# Altium schematic sheet SCH_04_MCU.SchDoc
size A4; DrawnBy: Phung Nhat Minh; SheetNumber: 4; SheetTotal: 7
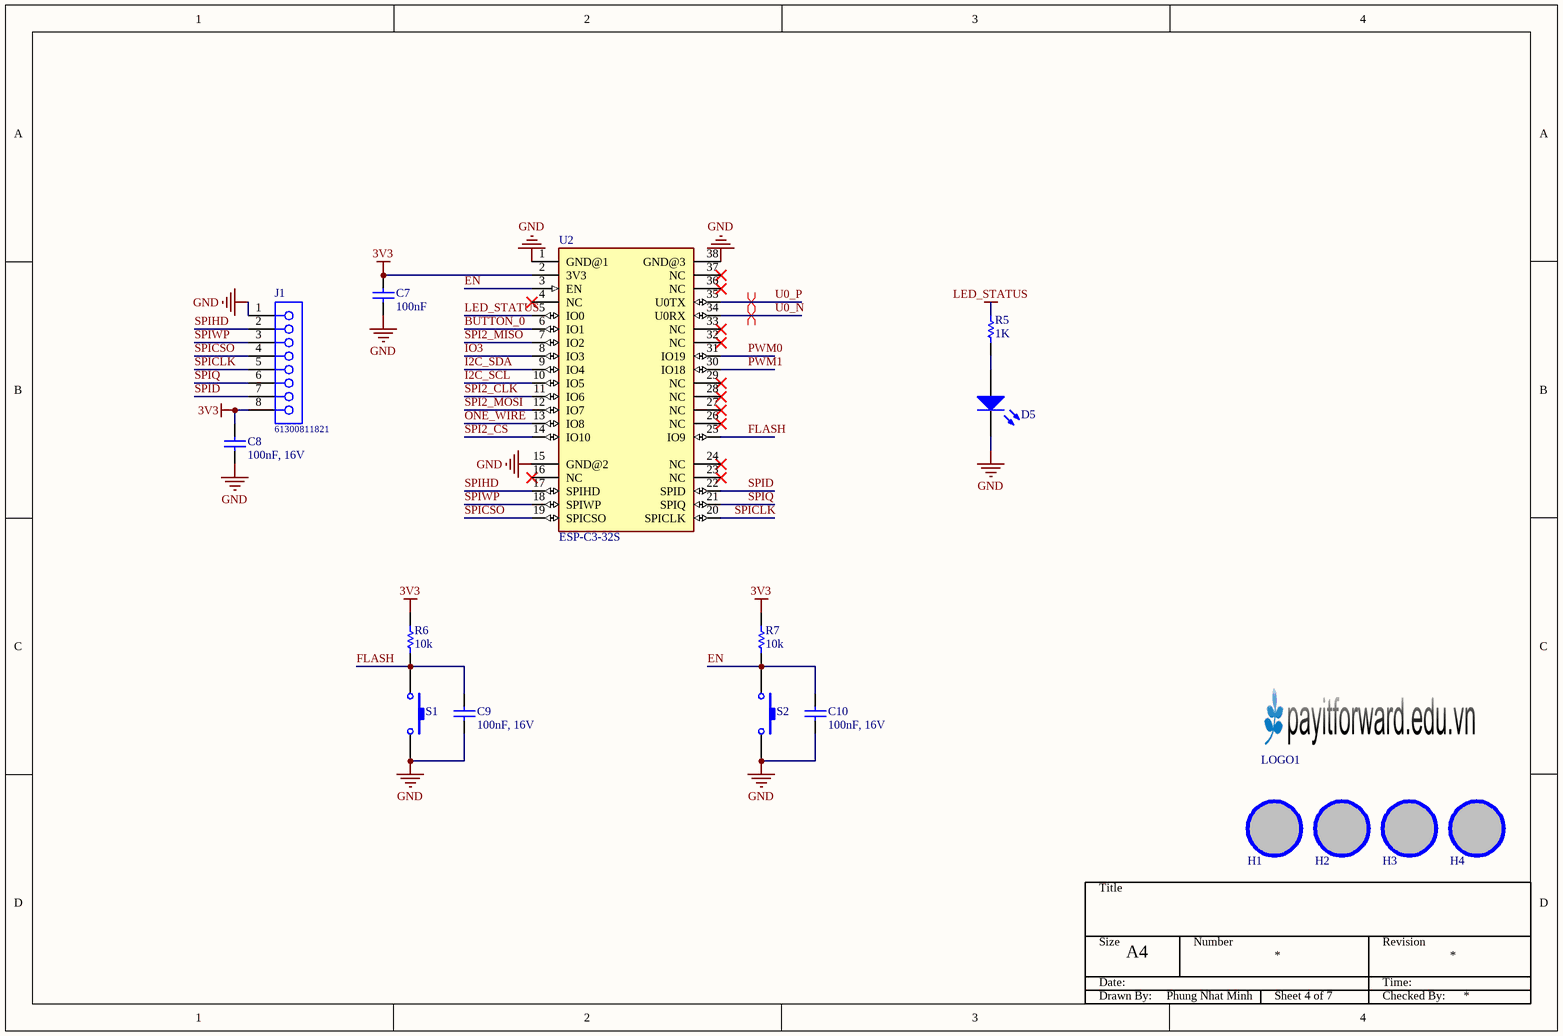
[diagram p0: SCH_04_MCU.SchDoc]

## Parts
C7  100nF  [WCAP-CSGP_0603_H=0.8mm_Reflow]
C8  100nF, 16V  [WCAP-CSGP_0603_H=0.8mm_Reflow]
C9  100nF, 16V  [WCAP-CSGP_0603_H=0.8mm_Reflow]
C10  100nF, 16V  [WCAP-CSGP_0603_H=0.8mm_Reflow]
D5  LED SMD  [LED_0805_Blue]  (value not drawn)
H1  Hole  [LO KHOAN 3MM]  (value not drawn)
H2  Hole  [LO KHOAN 3MM]  (value not drawn)
H3  Hole  [LO KHOAN 3MM]  (value not drawn)
H4  Hole  [LO KHOAN 3MM]  (value not drawn)
J1  61300811821  [61300811821]
LOGO1  LOGO PIF  [PIF LOGO BIG SSTOP]  (value not drawn)
R5  value 1K  [RES-SM-0603]  (hidden comment: RESISTOR SMD)
R6  value 10k  [RES-SM-0603]  (hidden comment: RESISTOR SMD)
R7  value 10k  [RES-SM-0603]  (hidden comment: RESISTOR SMD)
S1  Tact SW - 2Pin  [SW-SMD]  (value not drawn)
S2  Tact SW - 2Pin  [SW-SMD]  (value not drawn)
U2  ESP-C3-32S  [ESP-32S]

## Nets
3V3: C7.2 C8.2 J1.8 R6.1 R7.1 U2.2(3V3)
GND: C7.1 C8.1 C9.1 C10.1 D5.2(K) J1.1 S1.2 S2.2 U2.1(GND@1) U2.15(GND@2) U2.38(GND@3)
LED_STATUS: R5.2 U2.5(IO0)
BUTTON_0: U2.6(IO1)
EN: C10.2 R7.2 S2.1 U2.3(EN)
FLASH: C9.2 R6.2 S1.1 U2.25(IO9)
I2C_SCL: U2.10(IO5)
I2C_SDA: U2.9(IO4)
IO3: U2.8(IO3)
ONE_WIRE: U2.13(IO8)
PWM0: U2.31(IO19)
PWM1: U2.30(IO18)
SPI2_CLK: U2.11(IO6)
SPI2_CS: U2.14(IO10)
SPI2_MISO: U2.7(IO2)
SPI2_MOSI: U2.12(IO7)
SPICLK: J1.5 U2.20(SPICLK)
SPICSO: J1.4 U2.19(SPICSO)
SPID: J1.7 U2.22(SPID)
SPIHD: J1.2 U2.17(SPIHD)
SPIQ: J1.6 U2.21(SPIQ)
SPIWP: J1.3 U2.18(SPIWP)
U0_N: U2.34(U0RX)
U0_P: U2.35(U0TX)
NetD5_1: D5.1(A) R5.1

Not connected (* = marked no-connect by the designer): H1 1; H2 1; H3 1; H4 1; U2 4(NC)* 16(NC)* 23(NC)* 24(NC)* 26(NC)* 27(NC)* 28(NC)* 29(NC)* 32(NC)* 33(NC)* 36(NC)* 37(NC)*

## Layout directives
differential pair: U0_N, U0_P

## Notes on the sheet
- Title
- Size
- Date:
- A4
- Number
- Revision
- Time:
- Drawn By:
- Checked By:

## Library data of the parts
C7-C10 = 885012206046: WCAP-CSGP Multilayer Ceramic Chip Capacitor, General Purpose, size 0603, X7R, 100nF, 16V; Manufacturer: Wurth Elektronik; Rated Voltage: 16VDC; Isolation Resistance: >=5GOhm; Capacitance Tolerance: +/-10%; Technical Reference: X7R0603104K016DFCT10000; ComponentLink1Description: Manufacturer; ComponentLink1URL: http://www.we-online.de; ComponentLink2Description: Datasheet; ComponentLink2URL: https://www.we-online.com/catalog/datasheet/885012206046.pdf; Operating Temperature: -55 to +125degC; Packaging: Tape and Reel; Manufacturer Part Number: 885012206046; Published Date: May 2020; Ceramic Type: X7R; Dissipation Factor: =<3.5%; Height: 0.8mm; Mounting Technology: SMT; Size: 0603; Capacitance: 100nF
D5 = LED SMD: LED
H1-H4 = Hole: Hole 3mm
J1 = 61300811821: WR-PHD Socket Header, THT, pitch 2.54mm, Single Row, Vertical, 8p; Manufacturer: Wurth Elektronik; Pin Number: 8; Rated Current: 3A; Working Voltage: 250VAC; Withstanding Voltage: 500VAC; Contact Resistance: 20mOhm; ComponentLink1Description: Manufacturer; ComponentLink1URL: http://www.we-online.de; ComponentLink2Description: Datasheet; ComponentLink2URL: https://www.we-online.com/catalog/datasheet/61300811821.pdf; Manufacturer Part Number: 61300811821; Published Date: May 2020; Pitch: 2.54mm; Operating Temperature: -40 to +125degC; Mounting Technology: THT; Packaging: Tray; Gender: Socket Header; Row Number: Single; Orientation: Vertical
R5-R7 = RESISTOR SMD: Resistor
S1 S2 = Tact SW - 2Pin: Switch button 2 pin
U2 = ESP-C3-32S: - - Transceiver Module - - Surface Mount; MF: Olimex LTD; MP: ESP-32S; Package: None; Availability: Not in stock; Price: None; SnapEDA_Link: https://www.snapeda.com/parts/ESP-32S/Olimex+LTD/view-part/?ref=snap; Check_prices: https://www.snapeda.com/parts/ESP-32S/Olimex+LTD/view-part/?ref=eda; Value: *